# Altium project steering_pcb_rev1.0.PrjPcb
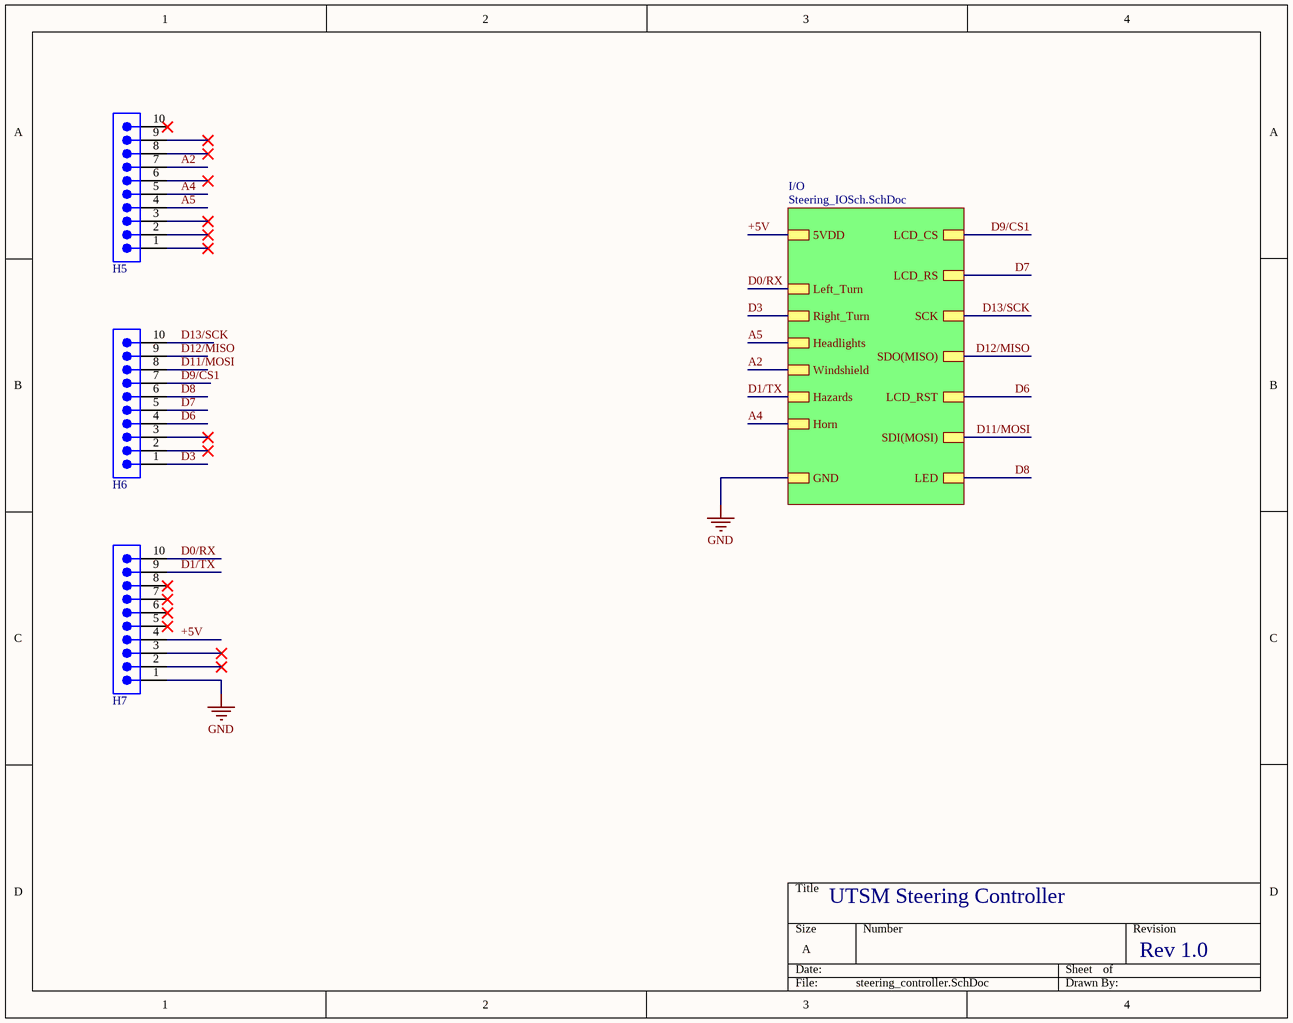
[diagram p0: steering_controller.SchDoc]
2 sheets, 10 parts. Net scope: hierarchical (ports join the sheet entries above them; power ports are global).
Board file: steering_controller.PcbDoc
Sheets:
  steering_controller.SchDoc
    I/O = Steering_IOSch.SchDoc

## Sheet steering_controller.SchDoc
size A; SheetNumber: 1; SheetTotal: 2

### Parts
H5  61301011121  [61301011121]  (value not drawn)
H6  61301011121  [61301011121]  (value not drawn)
H7  61301011121  [61301011121]  (value not drawn)

### Sub-sheets
I/O = Steering_IOSch.SchDoc: 5VDD, GND, Left_Turn, Right_Turn, Headlights, Windshield, Hazards, LCD_CS, LCD_RS, SCK, SDO(MISO), LCD_RST, SDI(MOSI), LED, Horn

### Nets
GND: H7.1 ; sheet I/O/GND
+5V: H7.4 ; sheet I/O/5VDD
A2: H5.7 ; sheet I/O/Windshield
A4: H5.5 ; sheet I/O/Horn
A5: H5.4 ; sheet I/O/Headlights
D0/RX: H7.10 ; sheet I/O/Left_Turn
D1/TX: H7.9 ; sheet I/O/Hazards
D3: H6.1 ; sheet I/O/Right_Turn
D6: H6.4 ; sheet I/O/LCD_RST
D7: H6.5 ; sheet I/O/LCD_RS
D8: H6.6 ; sheet I/O/LED
D9/CS1: H6.7 ; sheet I/O/LCD_CS
D11/MOSI: H6.8 ; sheet I/O/SDI(MOSI)
D12/MISO: H6.9 ; sheet I/O/SDO(MISO)
D13/SCK: H6.10 ; sheet I/O/SCK

Not connected (* = marked no-connect by the designer): H5 1* 2* 3* 6* 8* 9* 10*; H6 2* 3*; H7 2* 3* 5* 6* 7* 8*

### Notes on the sheet
- UTSM Steering Controller
- Rev 1.0

### Library data of the parts
H5-H7 = 61301011121: WR-PHD Pin Header, THT, Vertical, pitch 2.54mm, 1 Row, 10P; Manufacturer: Wurth Elektronik; Contact Resistance: 20mOhm; Rated Current: 3A; Working Voltage: 250V; Withstanding Voltage: 500V; Manufacturer Part Number: 61301011121; Category: Board-to-Board Connectors; Match Code: WR-PHD; ComponentLink1Description: Website Link; ComponentLink1URL: https://www.we-online.com/redexpert/article/61301011121?ad; ComponentLink2Description: Datasheet Link; ComponentLink2URL: https://www.we-online.com/redexpert/spec/61301011121?ad; Mount: Through Hole; Operating Temperature Max: 105°C; Operating Temperature Min: -40°C; Packaging: Bag; Gender: Pin Header; Number of Pins: 10; Number of Rows: 1; Orientation: Vertical; Pitch: 2.54mm

## Sheet Steering_IOSch.SchDoc
size A; SheetNumber: 2; SheetTotal: 2
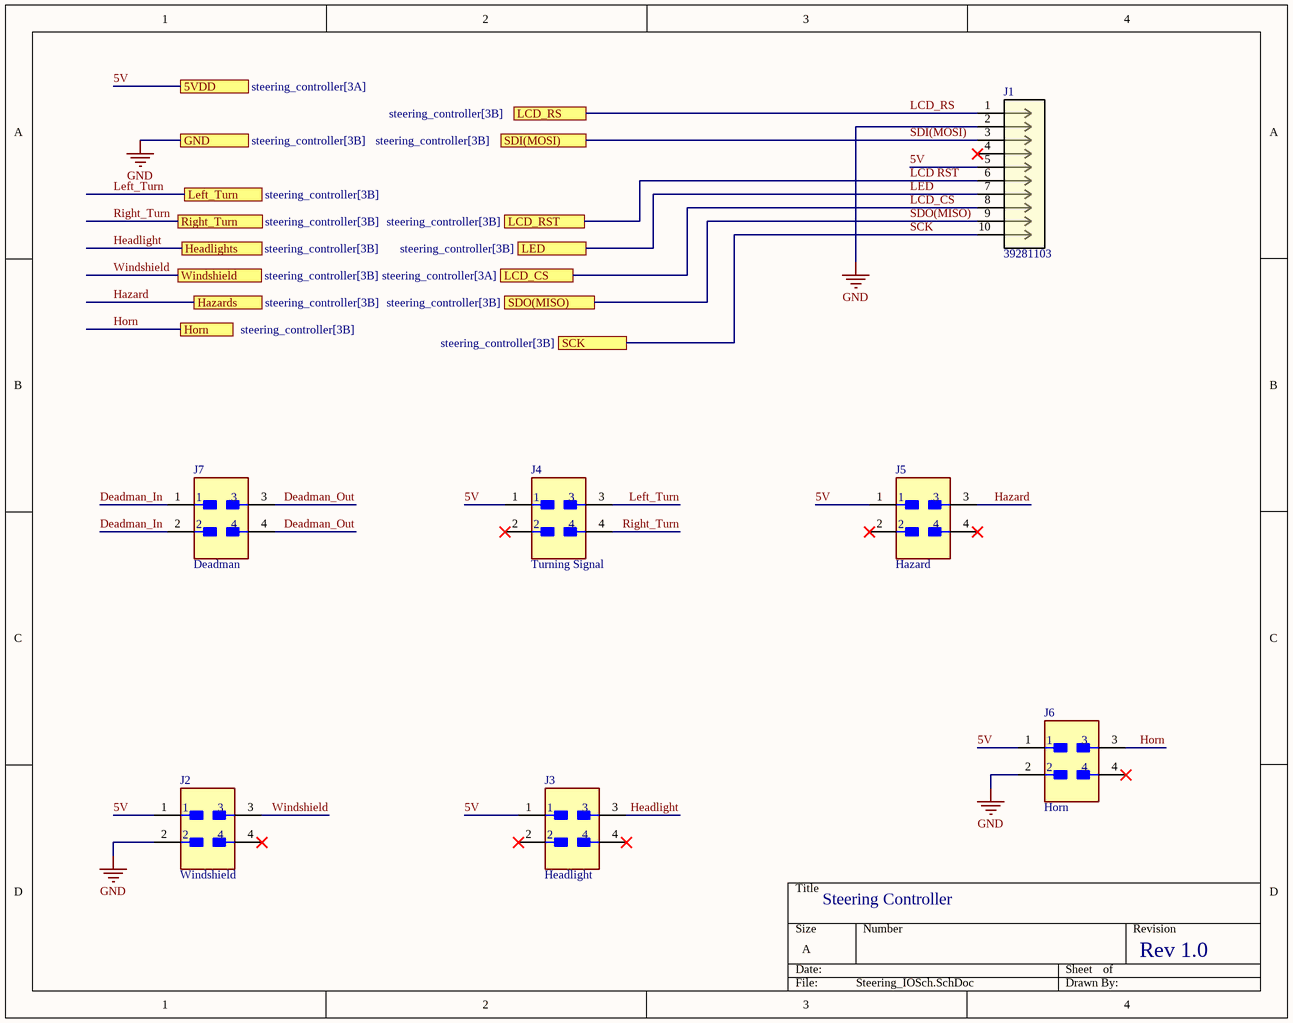
[diagram p1: Steering_IOSch.SchDoc]

### Parts
J1  39281103  [CON_39281103]
J2  Windshield  [FP-0039281043-MFG]
J3  Headlight  [FP-0039281043-MFG]
J4  Turning Signal  [FP-0039281043-MFG]
J5  Hazard  [FP-0039281043-MFG]
J6  Horn  [FP-0039281043-MFG]
J7  Deadman  [FP-0039281043-MFG]

### Ports
5VDD (see steering_controller[3A]), GND (see steering_controller[3B]), Hazards (see steering_controller[3B]), Headlights (see steering_controller[3B]), Horn (see steering_controller[3B]), LCD_CS (see steering_controller[3A]), LCD_RS (see steering_controller[3B]), LCD_RST (see steering_controller[3B]), LED (see steering_controller[3B]), Left_Turn (see steering_controller[3B]), Right_Turn (see steering_controller[3B]), SCK (see steering_controller[3B]), SDI(MOSI) (see steering_controller[3B]), SDO(MISO) (see steering_controller[3B]), Windshield (see steering_controller[3B])

### Nets
GND: J1.2 J2.2 J6.2 ; port GND
5V: J1.5 J2.1 J3.1 J4.1 J5.1 J6.1 ; port 5VDD  [project net +5V]
Deadman_In: J7.1 J7.2
Deadman_Out: J7.3 J7.4
Hazard: J5.3 ; port Hazards  [project net D1/TX]
Headlight: J3.3 ; port Headlights  [project net A5]
Horn: J6.3 ; port Horn  [project net A4]
LCD RST: J1.6 ; port LCD_RST  [project net D6]
LCD_CS: J1.8 ; port LCD_CS  [project net D9/CS1]
LCD_RS: J1.1 ; port LCD_RS  [project net D7]
LED: J1.7 ; port LED  [project net D8]
Left_Turn: J4.3 ; port Left_Turn  [project net D0/RX]
Right_Turn: J4.4 ; port Right_Turn  [project net D3]
SCK: J1.10 ; port SCK  [project net D13/SCK]
SDI(MOSI): J1.3 ; port SDI(MOSI)  [project net D11/MOSI]
SDO(MISO): J1.9 ; port SDO(MISO)  [project net D12/MISO]
Windshield: J2.3 ; port Windshield  [project net A2]

Not connected (* = marked no-connect by the designer): J1 4*; J2 4*; J3 2* 4*; J4 2*; J5 2* 4*; J6 4*

### Notes on the sheet
- Steering Controller
- Rev 1.0

### Library data of the parts
J1 = 39281103: No Description Available; Mfr_Name: Molex Connector Corporation; RefDes: RefDes; Type: Type
J2-J7 = 1x4_FEMALE_POWER: CONN HEADER VERT 4POS 4.2MM. 0039281043; Manufacturer: Molex; Conn Orientation: Vertical; Conn Gender: Male; Current Rating: 9A; Voltage Rating: 600V; Number Of Contacts: 4; Pitch: 4.2mm; Manufacturer Part Number: 0039281043; Lead Free: Yes; Category: Conn; Height: 13.1mm; ComponentLink2URL: https://www.molex.com/webdocs/datasheets/pdf/en-us/0039281043_PCB_HEADERS.pdf; Package: 0; Device Class L2: Headers and Wire Housings; Contact Material: Tin; Footprint Url: https://www.molex.com/pdm_docs/sd/039281043_sd.pdf; Device Class L1: Connectors; Temperature Range High: +105°C; Automotive: No; RoHS: TRUE; Temperature: -40°C to +105°C; Number Of Rows: 2; Digikey Description: CONN HEADER VERT 4POS 4.2MM; Temperature Range Low: -40°C; Octopart: https://octopart.com/39-28-1043-molex-7613; Device Class L3: unset; ComponentLink2Description: Datasheet

## Nets that join several sheets
GND: steering_controller (H7.1), Steering_IOSch (J1.2 J2.2 J6.2)
+5V: steering_controller (H7.4), Steering_IOSch (6 pins)
A2: steering_controller (H5.7), Steering_IOSch (J2.3)
A4: steering_controller (H5.5), Steering_IOSch (J6.3)
A5: steering_controller (H5.4), Steering_IOSch (J3.3)
D0/RX: steering_controller (H7.10), Steering_IOSch (J4.3)
D1/TX: steering_controller (H7.9), Steering_IOSch (J5.3)
D3: steering_controller (H6.1), Steering_IOSch (J4.4)
D6: steering_controller (H6.4), Steering_IOSch (J1.6)
D7: steering_controller (H6.5), Steering_IOSch (J1.1)
D8: steering_controller (H6.6), Steering_IOSch (J1.7)
D9/CS1: steering_controller (H6.7), Steering_IOSch (J1.8)
D11/MOSI: steering_controller (H6.8), Steering_IOSch (J1.3)
D12/MISO: steering_controller (H6.9), Steering_IOSch (J1.9)
D13/SCK: steering_controller (H6.10), Steering_IOSch (J1.10)